# Altium schematic sheet PIC18F56Q83.SchDoc
size A4; SheetNumber: 1; SheetTotal: 7
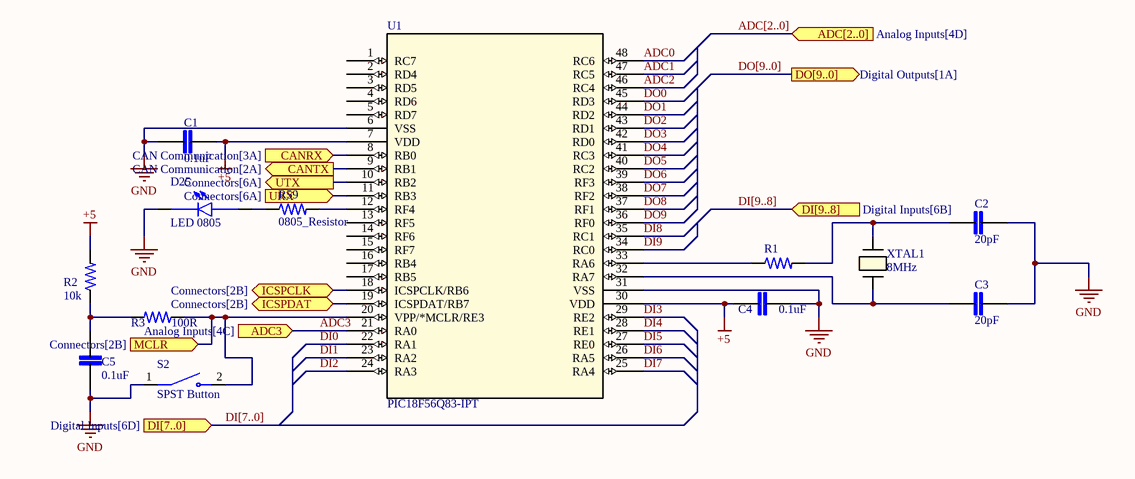
[diagram p0: PIC18F56Q83.SchDoc]

## Parts
C1  0.1uF  [0805]
C2  20pF  [0805]
C3  20pF  [0805]
C4  0.1uF  [0805]
C5  0.1uF  [0805]
D25  LED 0805  [LED 0805]
R1  0805_Resistor  [0805]  (value not drawn)
R2  10k  [0805]
R3  100R  [0805]
R59  0805_Resistor  [0805]
S2  SPST Button  [SPST Button]
U1  PIC18F56Q83-IPT  [PIC18F56Q83-IPT]
XTAL1  8MHz  [Crystal 8MHz]

## Ports
ADC3 (in, see Analog Inputs[4C]), ADC[2..0] (in, see Analog Inputs[4D]), CANRX (in, see CAN Communication[3A]), CANTX (out, see CAN Communication[2A]), DI[7..0] (in, see Digital Inputs[6D]), DI[9..8] (in, see Digital Inputs[6B]), DO[9..0] (out, see Digital Outputs[1A]), ICSPCLK (bidir, see Connectors[2B]), ICSPDAT (bidir, see Connectors[2B]), MCLR (in, see Connectors[2B]), URX (in, see Connectors[6A]), UTX (out, see Connectors[6A])

## Nets
+5: C1.1 C4.1 R2.2 U1.7(VDD) U1.30(VDD)
GND: C1.2 C2.2 C3.2 C4.2 C5.1 D25.C S2.1 U1.6(VSS) U1.31(VSS)
ADC0: U1.48(RC6)
ADC1: U1.47(RC5)
ADC2: U1.46(RC4)
ADC3: U1.21(RA0) ; port ADC3
CANRX: U1.8(RB0) ; port CANRX
CANTX: U1.9(RB1) ; port CANTX
DI0: U1.22(RA1)
DI1: U1.23(RA2)
DI2: U1.24(RA3)
DI3: U1.29(RE2)
DI4: U1.28(RE1)
DI5: U1.27(RE0)
DI6: U1.26(RA5)
DI7: U1.25(RA4)
DI8: U1.35(RC1)
DI9: U1.34(RC0)
DO0: U1.45(RD3)
DO1: U1.44(RD2)
DO2: U1.43(RD1)
DO3: U1.42(RD0)
DO4: U1.41(RC3)
DO5: U1.40(RC2)
DO6: U1.39(RF3)
DO7: U1.38(RF2)
DO8: U1.37(RF1)
DO9: U1.36(RF0)
ICSPCLK: U1.18(ICSPCLK/RB6) ; port ICSPCLK
ICSPDAT: U1.19(ICSPDAT/RB7) ; port ICSPDAT
MCLR: R3.1 S2.2 U1.20(VPP/*MCLR/RE3) ; port MCLR
URX: U1.11(RB3) ; port URX
UTX: U1.10(RB2) ; port UTX
NetC2_1: C2.1 R1.2 XTAL1.2
NetC3_1: C3.1 U1.32(RA7) XTAL1.1
NetC5_2: C5.2 R2.1 R3.2
NetD25_A: D25.A R59.1
NetR1_1: R1.1 U1.33(RA6)
NetR59_2: R59.2 U1.12(RF4)

Not connected (* = marked no-connect by the designer): U1 1(RC7) 2(RD4) 3(RD5) 4(RD6) 5(RD7) 13(RF5) 14(RF6) 15(RF7) 16(RB4) 17(RB5)

## Buses and harness runs
bus ADC[2..0] = port ADC[2..0]
bus DI[7..0] = port DI[7..0]
bus DI[9..8] = port DI[9..8]
bus DO[9..0] = port DO[9..0]

## Library data of the parts
C1-C5 = 0805_Capacitor: MP: LD051A121KAB2A; MF: AVX; SnapEDA_Link: https://www.snapeda.com/parts/LD051A121KAB2A/AVX/view-part/?ref=snap; Package: 0805 AVX; Check_prices: https://www.snapeda.com/parts/LD051A121KAB2A/AVX/view-part/?ref=eda; Purchase-URL: https://pricing.snapeda.com/search/part/LD051A121KAB2A/?ref=eda; Price: None; Value: *; Availability: In Stock
D25 = LED 0805: LED Uni-Color Green 4-Pin Chip 0805 T/R; MP: 597-3305-607F; Availability: Unavailable; Value: *; Price: None; Package: None
R1-R3 R59 = 0805_Resistor: Power_Rating: .25 W; MP: 2-2176053-0; Tolerance: 1%; Resistance: .33; MF: TE Connectivity; Price: None; Availability: In Stock; EU_RoHS_Compliance: Compliant with Exemptions; Package: 0805; Value: *; SnapEDA_Link: https://www.snapeda.com/parts/2-2176053-0/TE+Connectivity/view-part/?ref=snap; Check_prices: https://www.snapeda.com/parts/2-2176053-0/TE+Connectivity/view-part/?ref=eda
S2 = SPST Button: 3mmX6mm; MP: B3U-1000P; Price: None; Availability: Unavailable; Value: *; Package: None
U1 = PIC18F56Q83-IPT: No Description Available; Mfr_Name: Microchip; RefDes: RefDes; Type: Type
XTAL1 = Crystal 8MHz: 5032; Mfr_Name: Epson; Manufacturer_Part_Number: SC32A-12.5PF20PPM; Copyright: Copyright (C) 2024 Ultra Librarian. All rights reserved.; RefDes: RefDes; Type: DEV